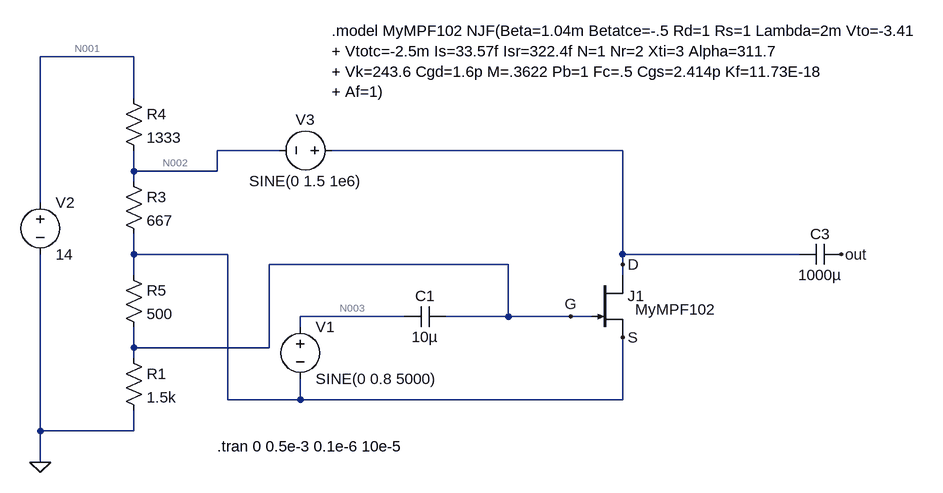
[diagram p0: schematic Third_attempt_JFET_AM_circuit.asc]
Third_attempt_JFET_AM_circuit.asc, the LTspice schematic file:
Version 4
SHEET 1 1424 680
WIRE -512 -208 -656 -208
WIRE -512 -144 -512 -208
WIRE -288 -64 -384 -64
WIRE 240 -64 -208 -64
WIRE -512 -32 -512 -64
WIRE -384 -32 -384 -64
WIRE -384 -32 -512 -32
WIRE -512 -16 -512 -32
WIRE -656 16 -656 -208
WIRE -512 96 -512 64
WIRE -368 96 -512 96
WIRE 240 96 240 -64
WIRE 512 96 240 96
WIRE 64 112 -304 112
WIRE 240 112 240 96
WIRE -512 128 -512 96
WIRE 240 128 240 112
WIRE -96 192 -256 192
WIRE 64 192 64 112
WIRE 64 192 -32 192
WIRE 160 192 64 192
WIRE 192 192 160 192
WIRE -256 208 -256 192
WIRE -512 240 -512 208
WIRE -304 240 -304 112
WIRE -304 240 -512 240
WIRE -512 256 -512 240
WIRE -368 320 -368 96
WIRE -256 320 -256 288
WIRE -256 320 -368 320
WIRE 240 320 240 224
WIRE 240 320 -256 320
WIRE -656 368 -656 96
WIRE -512 368 -512 336
WIRE -512 368 -656 368
WIRE -656 416 -656 368
FLAG 160 192 G
FLAG 240 112 D
FLAG 240 224 S
FLAG 576 96 out
FLAG -656 416 0
SYMBOL njf 192 128 R0
WINDOW 3 67 53 Left 2
SYMATTR Value MyMPF102
SYMATTR InstName J1
SYMBOL cap -32 176 R90
WINDOW 0 0 32 VBottom 2
WINDOW 3 32 32 VTop 2
SYMATTR InstName C1
SYMATTR Value 10µ
SYMBOL voltage -256 192 R0
WINDOW 123 24 124 Left 2
WINDOW 39 0 0 Left 0
SYMATTR InstName V1
SYMATTR Value SINE(0 0.8 5000)
SYMBOL cap 576 80 R90
WINDOW 0 0 32 VBottom 2
WINDOW 3 32 32 VTop 2
SYMATTR InstName C3
SYMATTR Value 1000µ
SYMBOL voltage -656 0 R0
WINDOW 123 0 0 Left 0
WINDOW 39 0 0 Left 0
SYMATTR InstName V2
SYMATTR Value 14
SYMBOL res -528 -32 R0
SYMATTR InstName R3
SYMATTR Value 667
SYMBOL res -528 112 R0
SYMATTR InstName R5
SYMATTR Value 500
SYMBOL res -528 240 R0
SYMATTR InstName R1
SYMATTR Value 1.5k
SYMBOL voltage -192 -64 R90
WINDOW 0 -32 56 VBottom 2
WINDOW 3 32 56 VTop 2
WINDOW 123 0 0 Left 0
WINDOW 39 0 0 Left 0
SYMATTR InstName V3
SYMATTR Value SINE(0 1.5 1e6)
SYMBOL res -528 -160 R0
SYMATTR InstName R4
SYMATTR Value 1333
TEXT -208 -248 Left 2 !.model MyMPF102 NJF(Beta=1.04m Betatce=-.5 Rd=1 Rs=1 Lambda=2m Vto=-3.41\n+ Vtotc=-2.5m Is=33.57f Isr=322.4f N=1 Nr=2 Xti=3 Alpha=311.7\n+ Vk=243.6 Cgd=1.6p M=.3622 Pb=1 Fc=.5 Cgs=2.414p Kf=11.73E-18\n+ Af=1)
TEXT -384 392 Left 2 !.tran 0 0.5e-3 0.1e-6 10e-5

The netlist it stands for:
* Third_attempt_JFET_AM_circuit.asc
J1 D G S MyMPF102
C1 G N003 10µ
V1 N003 S SINE(0 0.8 5000)
C3 out D 1000µ
V2 N001 0 14
R3 N002 S 667
R5 S G 500
R1 G 0 1.5k
V3 D N002 SINE(0 1.5 1e6)
R4 N001 N002 1333
.model NJF NJF
.model PJF PJF
.lib standard.jft
.model MyMPF102 NJF(Beta=1.04m Betatce=-.5 Rd=1 Rs=1 Lambda=2m Vto=-3.41
+ Vtotc=-2.5m Is=33.57f Isr=322.4f N=1 Nr=2 Xti=3 Alpha=311.7
+ Vk=243.6 Cgd=1.6p M=.3622 Pb=1 Fc=.5 Cgs=2.414p Kf=11.73E-18
+ Af=1)
.tran 0 0.5e-3 0.1e-6 10e-5
.backanno
.end

* Results of the author's LTspice run, read from the files saved beside the schematic
* Operating Point, zero values left out:
*   V(d) = 8.856 V
*   V(g) = 5.789 V
*   V(s) = 7.718 V
*   V(n003) = 7.718 V
*   V(out) = 8.847 mV
*   V(n001) = 14 V
*   V(n002) = 8.856 V
*   Id(J1) = 2.154 mA
*   Ig(J1) = -6.076 pA
*   Is(J1) = -2.154 mA
*   I(R4) = 3.859 mA
*   I(R1) = 3.859 mA
*   I(R5) = 3.859 mA
*   I(R3) = 1.705 mA
*   I(V3) = -2.154 mA
*   I(V2) = -3.859 mA